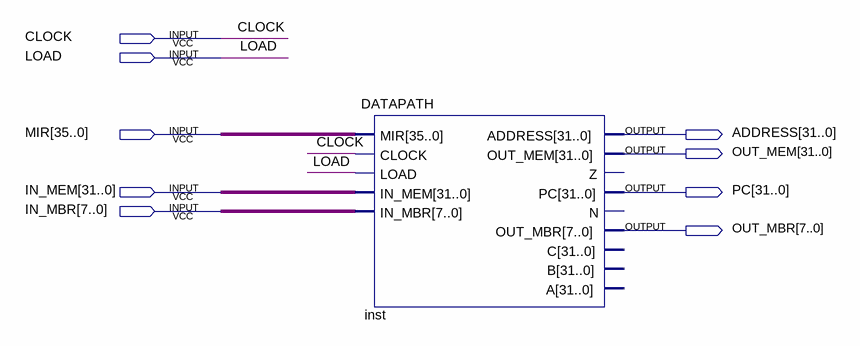
[diagram p0: schematic sheet]
// Quartus schematic CPU.bdf as structural Verilog: 1 symbols, 9 pins
module CPU (
  input  CLOCK,
  input  LOAD,
  input  [35:0] MIR,
  input  [31:0] IN_MEM,
  input  [7:0] IN_MBR,
  output [31:0] ADDRESS,
  output [31:0] OUT_MEM,
  output [31:0] PC,
  output [7:0] OUT_MBR
);

  DATAPATH inst (
    .MIR(MIR), .CLOCK(CLOCK), .LOAD(LOAD), .IN_MEM(IN_MEM), .IN_MBR(IN_MBR), .ADDRESS(ADDRESS),
    .OUT_MEM(OUT_MEM), .PC(PC), .OUT_MBR(OUT_MBR));  // open: Z, N, C, B, A
endmodule
